# EAGLE design ledcandle (EAGLE 6.2)
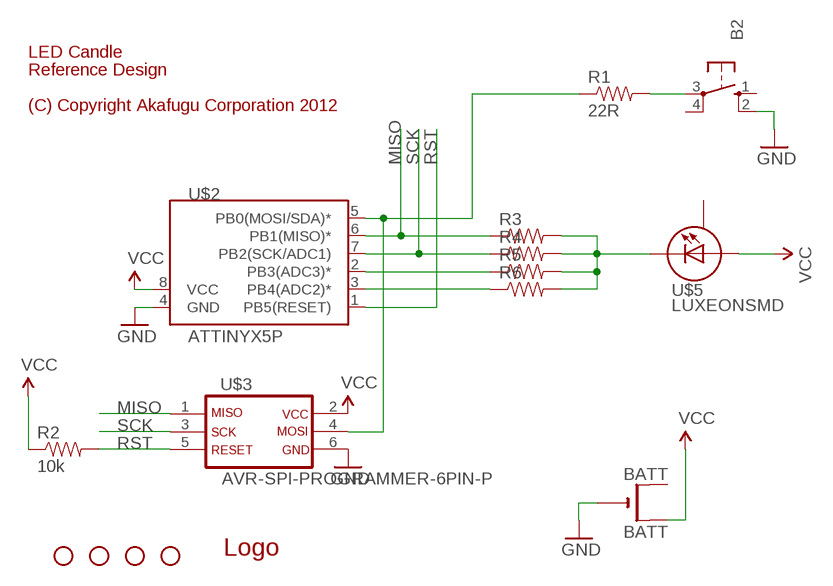
[diagram p0: schematic, sheet 1]

## Parts
B2  10-XX  [B3F-10XX]
BATT  BATT  COIN-CELL-CR2032-THM-PAD  [CR2032-THM-PAD]
JP1  STAND-OFF  [STAND-OFF]
JP2  STAND-OFF  [STAND-OFF]
JP3  STAND-OFF  [STAND-OFF]
JP4  STAND-OFF  [STAND-OFF]
R1  22R  RESISTOR-PTH-1/6W-OUTLINE  [1/6W-RES-OUTLINE]
R2  10k  RESISTOR-PTH-1/6W-OUTLINE  [1/6W-RES-OUTLINE]
R3  RESISTOR-PTH-1/6W-OUTLINE  [1/6W-RES-OUTLINE]
R4  RESISTOR-PTH-1/6W-OUTLINE  [1/6W-RES-OUTLINE]
R5  RESISTOR-PTH-1/6W-OUTLINE  [1/6W-RES-OUTLINE]
R6  RESISTOR-PTH-1/6W-OUTLINE  [1/6W-RES-OUTLINE]
U$1  OSHW-LOGO-FILL  [OSHW-LOGO-FILL]
U$2  ATTINYX5P  [DIL-8]
U$3  AVR-SPI-PROGRAMMER-6PIN-P  [2X03]
U$5  LUXEONSMD  [LUXEON]

## Nets
GND: B2.2(S1) BATT.- U$2.4(GND) U$3.6
MISO: R3.1 U$2.6(PB1(MISO)*) U$3.1
N$1: R6.1 U$2.3(PB4(ADC2)*)
N$2: R3.2 R4.2 R5.2 R6.2 U$5.C
N$4: R5.1 U$2.2(PB3(ADC3)*)
N$7: R1.1 U$2.5(PB0(MOSI/SDA)*) U$3.4
RESET: B2.3(P) R1.2
RST: R2.2 U$2.1(PB5(RESET)) U$3.5
SCK: R4.1 U$2.7(PB2(SCK/ADC1)) U$3.3
VCC: BATT.+2(+1) R2.1 U$2.8(VCC) U$3.2 U$5.A
Unconnected: B2.1(S) B2.4(P1) BATT.+1(+) U$5.S

## Notes on the sheet
- LED Candle
- Reference Design
- (C) Copyright Akafugu Corporation 2012

## Library data of the parts
B2 = switch-omron:10-XX: OMRON SWITCH
BATT = akafugu:COIN-CELL: Coin cell battery CR1220 3V (SMT and THM) CR2032 3V (THM) pending CR2450 3.3V (THM) Note the THM package has the ground pads on both sides of the PCB so that the masks are the same.
JP1-JP4 = SparkFun:STAND-OFF: Stand Off This is the mechanical footprint for a #4 phillips button head screw. Use the keepout ring to avoid running the screw head into surrounding components. SKU : PRT-00447
R1-R6 = akafugu:RESISTOR: Resistor Basic schematic elements and footprints for 0603, 1206, and PTH resistors.
U$1 = akafugu:OSHW-LOGO
U$2 = akafugu:ATTINYX5: ATTiny25/45/85 Microcontroller
U$3 = akafugu:AVR-SPI-PROGRAMMER-6PIN: AVR SPI Programmer Header, 6-pin 2x3-pin PTH and 2x3 SMT pad
U$5 = SparkFun:LUXEON: Luxeon LED This footprint works with the current 1 Watt, 3 Watt, and 5 Watt LEDs. These blindingly bright LEDs generate a lot of heat so the footprint has a large pad under the LED for thermal transfer. Schematic and footprint are proven. Spark Fun Electronics SKU : COM-00603

## Net classes
0 default: width 0.254 mm, drill 0.305 mm, clearance 0.152 mm

## Board
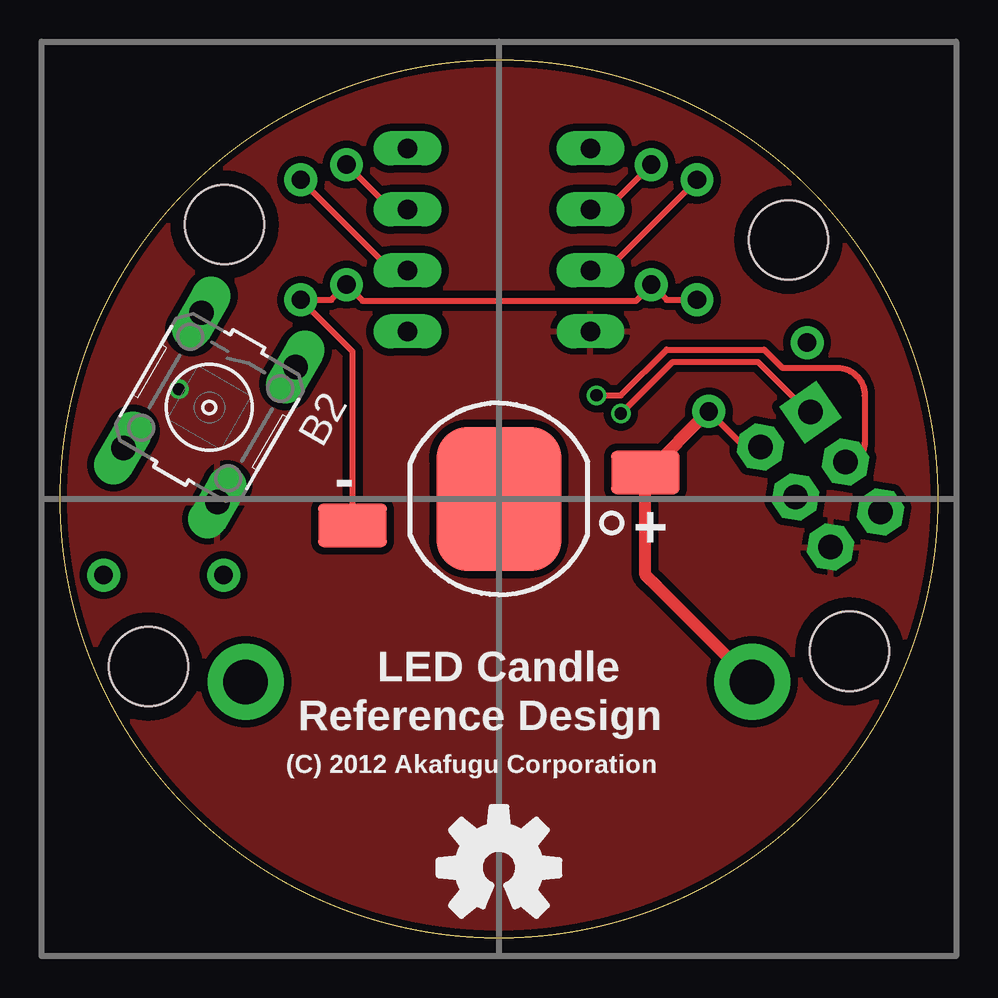
[diagram p1: board, top side]
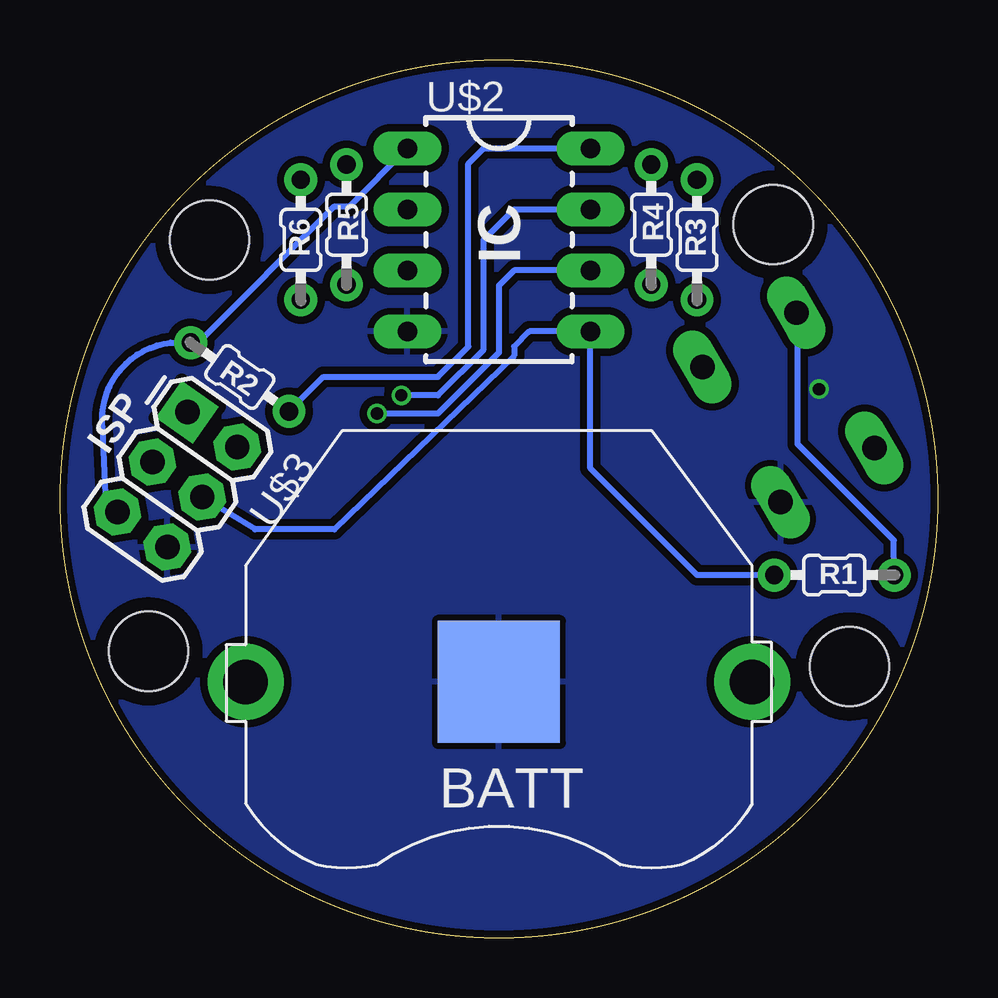
[diagram p2: board, bottom side, seen from below]

Size 36.58 x 36.58 mm. Coordinates in mm from the lower left corner, seen from the top.
Outline: circle at 18.29,18.29 radius 18.29
Copper layers (1*16): Top 0.035mm / dielectric 1.5mm / Bottom 0.035mm
Design rules: minimum track width 10mil, minimum drill 20mil, track to track 8mil, track to pad 8mil, pad to pad 8mil, via to via 8mil, smd to smd 0mil, copper to edge 12mil, drill to drill 10mil, minimum pad ring 12mil, minimum via ring 6mil, stop-mask expansion 2mil, vias tented up to drill 45mil, thermal gap 10mil

### Footprints (pad centres in the part's own frame; a part is rotated, then mirrored left to right if it is on the bottom)
B3F-10XX = drill 1.016 long: 1 -3.251,2.261; 2 3.251,2.261; 3 -3.251,-2.261; 4 3.251,-2.261
CR2032-THM-PAD = drill 1.854 pad 3.175: +1 -10.554,0; +2 10.554,0 | smd 5.08 x 5.08: - 0,0
STAND-OFF = hole 3.302: 0,0
1/6W-RES-OUTLINE = drill 0.762: 1 -2.5,0; 2 2.5,0
DIL-8 = drill 0.813 long: 1 -3.81,-3.81; 2 -1.27,-3.81; 3 1.27,-3.81; 4 3.81,-3.81; 5 3.81,3.81; 6 1.27,3.81; 7 -1.27,3.81; 8 -3.81,3.81
2X03 = drill 1.016 pad 1.88 square: 1 -2.54,-1.27 | drill 1.016 pad 1.88 octagon: 2 -2.54,1.27; 3 0,-1.27; 4 0,1.27; 5 2.54,-1.27; 6 2.54,1.27
LUXEON = smd 2.85 x 1.8: A -6.1,-1.1; C 6.1,1.1 | smd 5.2 x 6: S 0,0

### Placement (x,y rotation side)
B2  6.22,22.1 240 top
BATT  18.29,10.67 180 bottom
JP1  3.68,11.3 0 top
JP2  32.89,11.94 0 top
JP3  6.86,29.72 0 top
JP4  30.35,29.08 0 top
R1  4.32,15.11 0 bottom
R2  29.08,23.37 145 bottom
R3  10.03,29.08 270 bottom
R4  11.94,29.72 270 bottom
R5  24.64,29.72 270 bottom
R6  26.54,29.08 270 bottom
U$1  18.29,2.92 0 top
U$2  18.29,29.08 270 bottom
U$3  31.69,19.09 235 bottom
U$5  18.29,18.29 180 top

### Tracks (layer width: path | path; a pad name or v marks a point on that pad's centre or on a via)
GND  (via drill 0.51)
  other vias: 4.95,22.86
  pour Top (isolate 0.305): -1.03,40.34 39.5,40.34 40.5,-2.03 -2.03,-2.03
  pour Bottom (isolate 0.305): -1.4,39.7 38.86,39.7 39.86,-1.4 -1.4,-1.4
MISO  (via drill 0.51)
  Top 0.254: U$2.6 13.8,27.81 R3.1 | U$3.1 31.18,21.9 29.08,24 25.53,24 v23.37,21.84
  Bottom 0.254: U$2.6 17.65,27.81 18.29,27.18 18.29,24.38 20.83,21.84 v23.37,21.84
N$1
  Top 0.254: U$2.3 22.77,27.81 R6.1
N$2
  Top 0.254: R6.2 25.27,26.58 R5.2 24.64,27.18 24,26.54 12.61,26.54 R4.2 11.3,26.58 R3.2 12.19,24.43 U$5.C
N$4
  Top 0.254: U$2.2 22.77,30.35 R5.1
N$7
  Bottom 0.254: U$3.4 28.45,17.02 25.15,17.02 17.65,24.26 17.65,24.64 17.02,25.27 U$2.5 14.48,19.56 10.03,15.11 R1.1
RESET
  Bottom 0.254: R1.2 1.83,16.56 5.84,20.57 5.84,25.36 B2.3
RST
  Bottom 0.254: U$2.1 24.51,30.48 25.15,30.48 30.82,24.8 R2.2 31.97,24.8 arc-90 34.8,21.21 34.67,18.48 arc-90 U$3.5
SCK  (via drill 0.51)
  Top 0.254: U$2.7 13.8,30.35 R4.1 | U$3.3 arc90 33.53,20.62 33.53,22.61 arc90 32.38,23.75 30.1,23.75 29.34,24.51 25.27,24.51 23.37,22.61 v22.35,22.61
  Bottom 0.254: U$2.7 17.65,30.35 18.92,29.08 18.92,24.51 20.83,22.61 v22.35,22.61
VCC
  Top 0.254: U$3.2 28.52,20.45 R2.1
  Top 0.508: R2.1 24.49,19.39 U$5.A 24.39,15.12 24.9,14.61 BATT.+2
  Bottom 0.254: U$2.8 18.92,32.89 19.56,32.26 19.56,24.64 20.83,23.37 25.6,23.37 R2.1

### Text on the board
tPlace: - | + | LED Candle | Reference Design | (C) 2012 Akafugu Corporation
bPlace: R3 | R4 | IC | R5 | R6 | R2 | ISP | R1